# Altium schematic sheet HIVE_BOARD_CLOCK_GEN.SchDoc
size Tabloid; SheetNumber: 6; SheetTotal: 12; Sheet_Name: CLOCK GEN & FANOUT; Size: 11x17
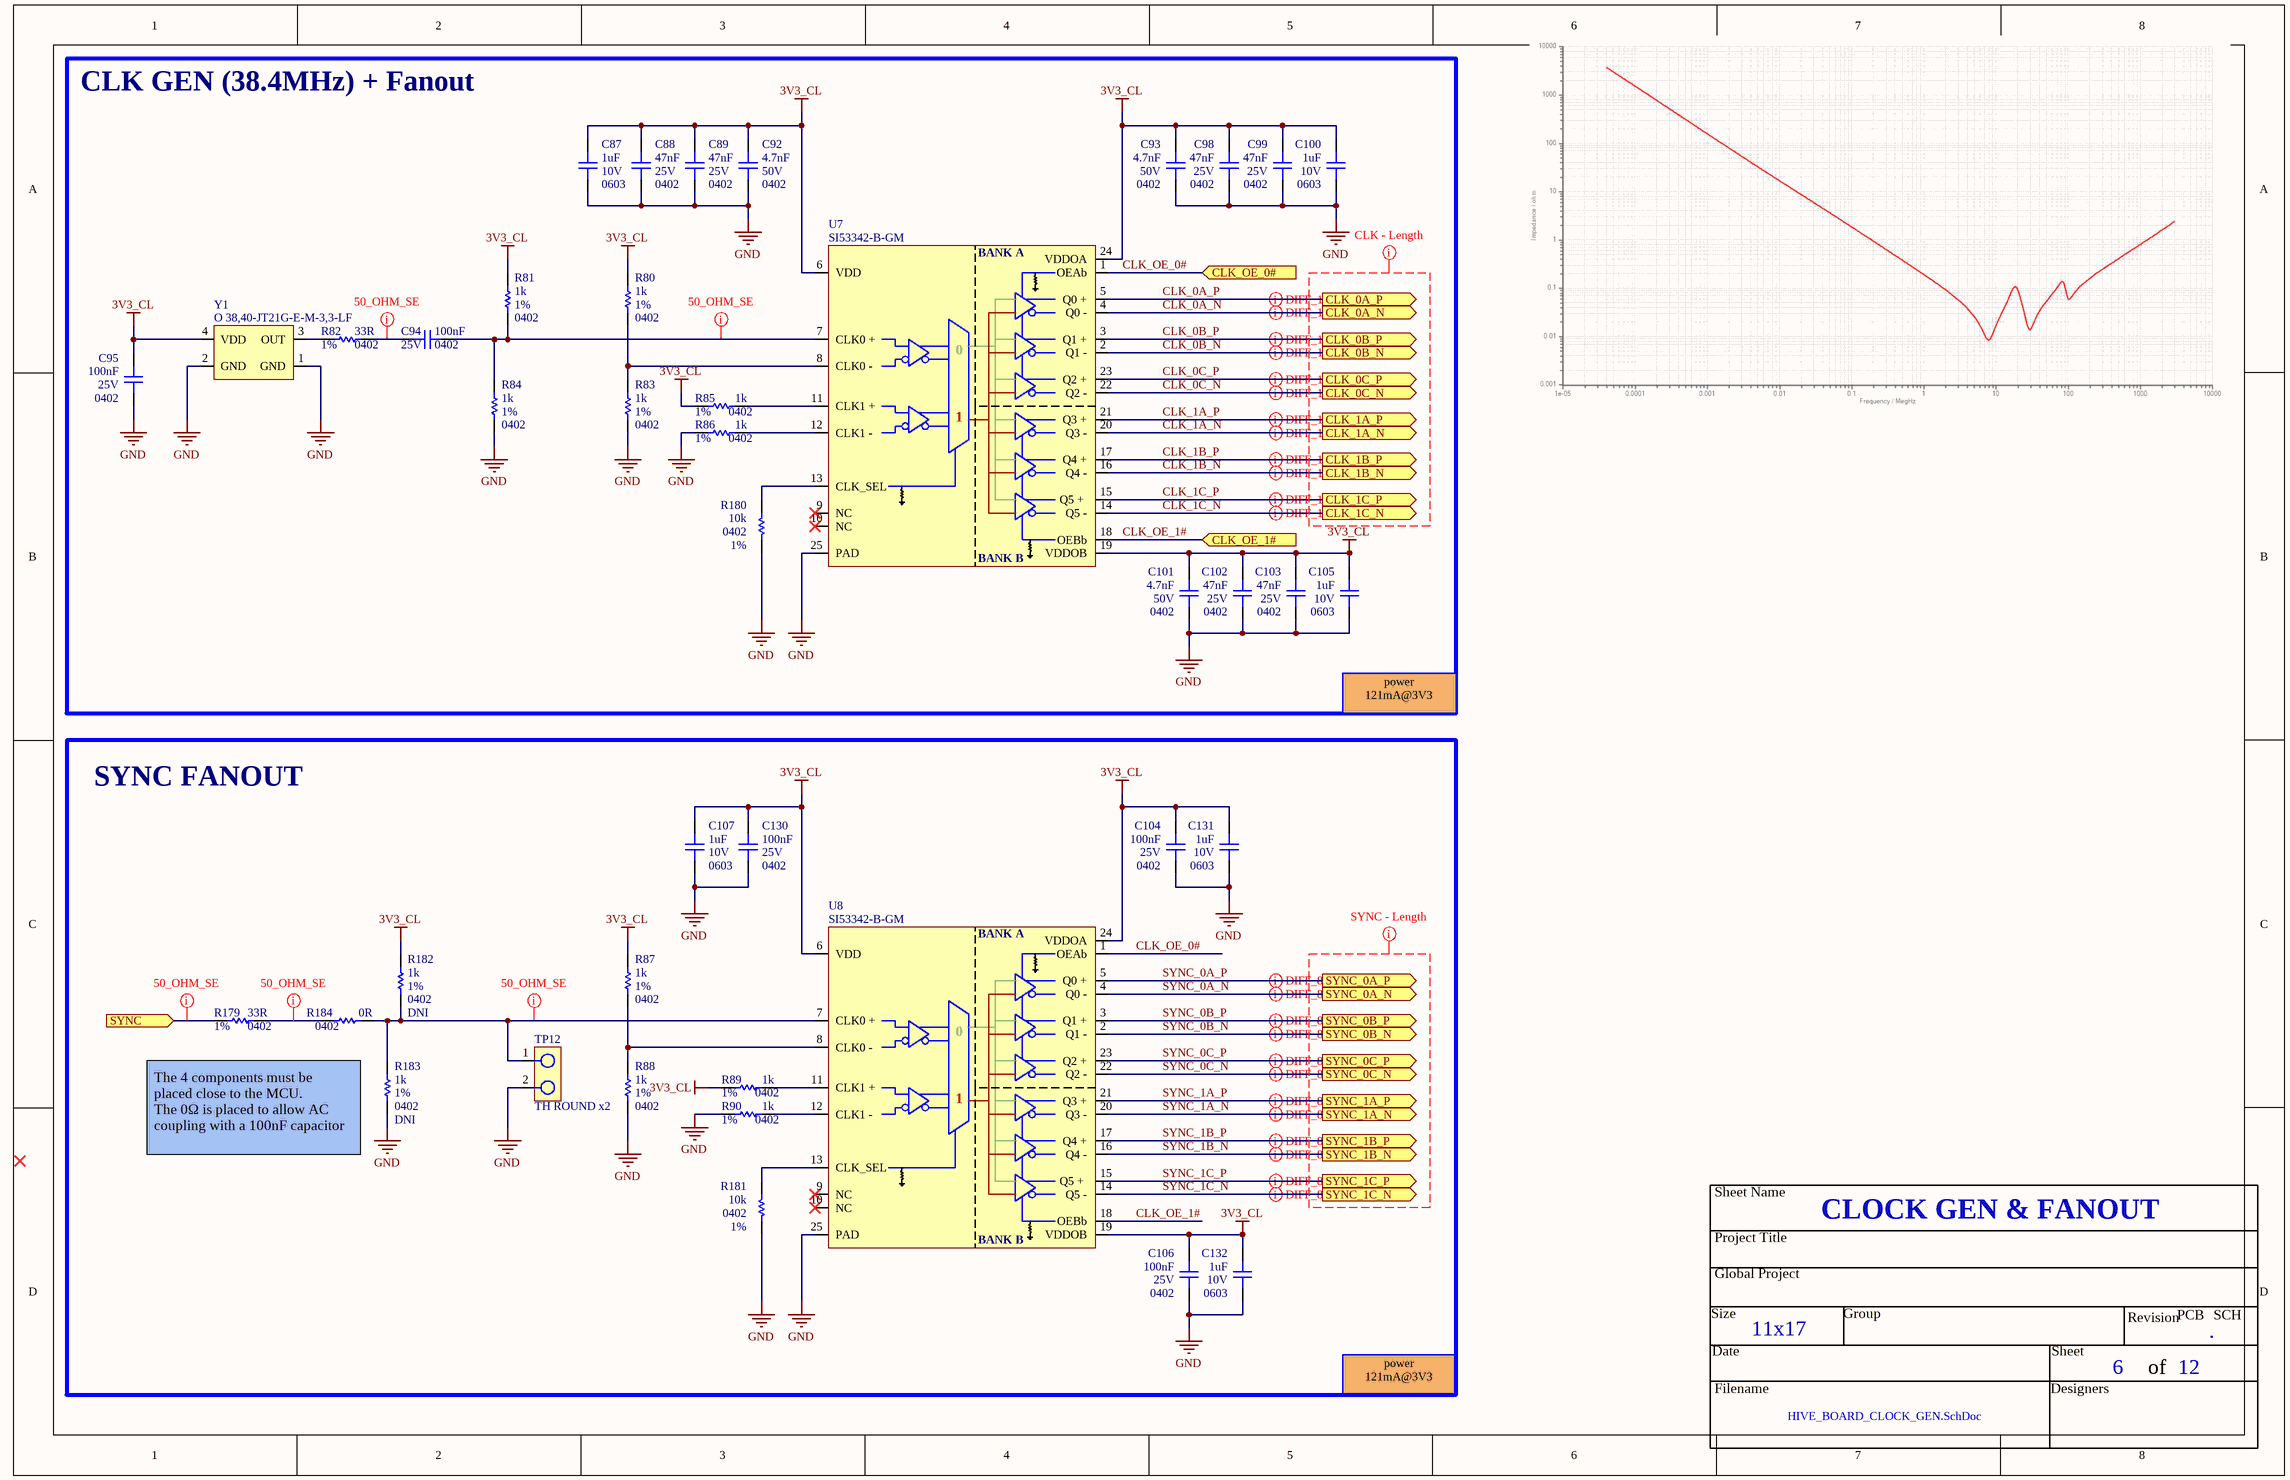
[diagram p0: HIVE_BOARD_CLOCK_GEN.SchDoc]

## Parts
C87  value 1uF  Package: 0603  Voltage Rating: 10V  [CAP_CER_0603]  (hidden comment: C0603C105K8PACTU)
C88  value 47nF  Package: 0402  Voltage Rating: 25V  [CAP_CER_0402]  (hidden comment: GRM155R71E473KA88J)
C89  value 47nF  Package: 0402  Voltage Rating: 25V  [CAP_CER_0402]  (hidden comment: GRM155R71E473KA88J)
C92  value 4.7nF  Package: 0402  Voltage Rating: 50V  [CAP_CER_0402]  (hidden comment: CL05B472KB5VPNC)
C93  value 4.7nF  Package: 0402  Voltage Rating: 50V  [CAP_CER_0402]  (hidden comment: CL05B472KB5VPNC)
C94  value 100nF  Package: 0402  Voltage Rating: 25V  [CAP_CER_0402]  (hidden comment: CGA2B3X7R1E104K050BB)
C95  value 100nF  Package: 0402  Voltage Rating: 25V  [CAP_CER_0402]  (hidden comment: CGA2B3X7R1E104K050BB)
C98  value 47nF  Package: 0402  Voltage Rating: 25V  [CAP_CER_0402]  (hidden comment: GRM155R71E473KA88J)
C99  value 47nF  Package: 0402  Voltage Rating: 25V  [CAP_CER_0402]  (hidden comment: GRM155R71E473KA88J)
C100  value 1uF  Package: 0603  Voltage Rating: 10V  [CAP_CER_0603]  (hidden comment: C0603C105K8PACTU)
C101  value 4.7nF  Package: 0402  Voltage Rating: 50V  [CAP_CER_0402]  (hidden comment: CL05B472KB5VPNC)
C102  value 47nF  Package: 0402  Voltage Rating: 25V  [CAP_CER_0402]  (hidden comment: GRM155R71E473KA88J)
C103  value 47nF  Package: 0402  Voltage Rating: 25V  [CAP_CER_0402]  (hidden comment: GRM155R71E473KA88J)
C104  value 100nF  Package: 0402  Voltage Rating: 25V  [CAP_CER_0402]  (hidden comment: CGA2B3X7R1E104K050BB)
C105  value 1uF  Package: 0603  Voltage Rating: 10V  [CAP_CER_0603]  (hidden comment: C0603C105K8PACTU)
C106  value 100nF  Package: 0402  Voltage Rating: 25V  [CAP_CER_0402]  (hidden comment: CGA2B3X7R1E104K050BB)
C107  value 1uF  Package: 0603  Voltage Rating: 10V  [CAP_CER_0603]  (hidden comment: C0603C105K8PACTU)
C130  value 100nF  Package: 0402  Voltage Rating: 25V  [CAP_CER_0402]  (hidden comment: CGA2B3X7R1E104K050BB)
C131  value 1uF  Package: 0603  Voltage Rating: 10V  [CAP_CER_0603]  (hidden comment: C0603C105K8PACTU)
C132  value 1uF  Package: 0603  Voltage Rating: 10V  [CAP_CER_0603]  (hidden comment: C0603C105K8PACTU)
R80  value 1k  Tolerance: 1%  Package: 0402  [RES_0402]  (hidden comment: RC0402FR-071KL)
R81  value 1k  Tolerance: 1%  Package: 0402  [RES_0402]  (hidden comment: RC0402FR-071KL)
R82  value 33R  Tolerance: 1%  Package: 0402  [RES_0402]  (hidden comment: RC0402FR-0733RL)
R83  value 1k  Tolerance: 1%  Package: 0402  [RES_0402]  (hidden comment: RC0402FR-071KL)
R84  value 1k  Tolerance: 1%  Package: 0402  [RES_0402]  (hidden comment: RC0402FR-071KL)
R85  value 1k  Tolerance: 1%  Package: 0402  [RES_0402]  (hidden comment: RC0402FR-071KL)
R86  value 1k  Tolerance: 1%  Package: 0402  [RES_0402]  (hidden comment: RC0402FR-071KL)
R87  value 1k  Tolerance: 1%  Package: 0402  [RES_0402]  (hidden comment: RC0402FR-071KL)
R88  value 1k  Tolerance: 1%  Package: 0402  [RES_0402]  (hidden comment: RC0402FR-071KL)
R89  value 1k  Tolerance: 1%  Package: 0402  [RES_0402]  (hidden comment: RC0402FR-071KL)
R90  value 1k  Tolerance: 1%  Package: 0402  [RES_0402]  (hidden comment: RC0402FR-071KL)
R179  value 33R  Tolerance: 1%  Package: 0402  [RES_0402]  (hidden comment: RC0402FR-0733RL)
R180  value 10k  Tolerance: 1%  Package: 0402  [RES_0402]  (hidden comment: RC0402FR-0710KL)
R181  value 10k  Tolerance: 1%  Package: 0402  [RES_0402]  (hidden comment: RC0402FR-0710KL)
R182  value 1k  Tolerance: 1%  Assembly Note: DNI  Package: 0402  [RES_0402]  (hidden comment: RC0402FR-071KL)
R183  value 1k  Tolerance: 1%  Assembly Note: DNI  Package: 0402  [RES_0402]  (hidden comment: RC0402FR-071KL)
R184  value 0R  Package: 0402  [RES_0402]  (hidden comment: RC0402FR-070RL)
TP12  TH ROUND x2  [TPO_TH_ROUND_0.7mm_DOUBLE]  (no BOM)
U7  SI53342-B-GM  [TIM_FAN_SI53342-B-GM]
U8  SI53342-B-GM  [TIM_FAN_SI53342-B-GM]
Y1  O 38,40-JT21G-E-M-3,3-LF  [OSC_O 38,40-JT21G-E-M-3,3-LF]

## Blocks framed on the sheet
CLK GEN (38.4MHz) + Fanout: C87-C89 C92-C95 C98-C103 C105 R80-R86 R180 U7 Y1
SYNC FANOUT: C104 C106 C107 C130-C132 R87-R90 R179 R181-R184 TP12 U8

## Ports
CLK_0A_N (out), CLK_0A_P (out), CLK_0B_N (out), CLK_0B_P (out), CLK_0C_N (out), CLK_0C_P (out), CLK_1A_N (out), CLK_1A_P (out), CLK_1B_N (out), CLK_1B_P (out), CLK_1C_N (out), CLK_1C_P (out), CLK_OE_0# (in), CLK_OE_1# (in), SYNC (in), SYNC_0A_N (out), SYNC_0A_P (out), SYNC_0B_N (out), SYNC_0B_P (out), SYNC_0C_N (out), SYNC_0C_P (out), SYNC_1A_N (out), SYNC_1A_P (out), SYNC_1B_N (out), SYNC_1B_P (out), SYNC_1C_N (out), SYNC_1C_P (out)

## Nets
3V3_CL: C87.1 C88.2 C89.2 C92.2 C93.2 C95.2 C98.2 C99.2 C100.1 C101.2 C102.2 C103.2 C104.2 C105.1 C106.2 C107.1 C130.2 C131.1 C132.1 R80.2 R81.2 R85.2 R87.2 R89.2 R182.2 U7.6(VDD) U7.19(VDDOB) U7.24(VDDOA) U8.6(VDD) U8.19(VDDOB) U8.24(VDDOA) Y1.4(VDD)
GND: C87.2 C88.1 C89.1 C92.1 C93.1 C95.1 C98.1 C99.1 C100.2 C101.1 C102.1 C103.1 C104.1 C105.2 C106.1 C107.2 C130.1 C131.2 C132.2 R83.1 R84.1 R86.2 R88.1 R90.2 R180.2 R181.2 R183.1 TP12.2 U7.25(PAD) U8.25(PAD) Y1.1(GND) Y1.2(GND)
CLK_0A_N: U7.4(Q0_-) ; port CLK_0A_N
CLK_0A_P: U7.5(Q0_+) ; port CLK_0A_P
CLK_0B_N: U7.2(Q1_-) ; port CLK_0B_N
CLK_0B_P: U7.3(Q1_+) ; port CLK_0B_P
CLK_0C_N: U7.22(Q2_-) ; port CLK_0C_N
CLK_0C_P: U7.23(Q2_+) ; port CLK_0C_P
CLK_1A_N: U7.20(Q3_-) ; port CLK_1A_N
CLK_1A_P: U7.21(Q3_+) ; port CLK_1A_P
CLK_1B_N: U7.16(Q4_-) ; port CLK_1B_N
CLK_1B_P: U7.17(Q4_+) ; port CLK_1B_P
CLK_1C_N: U7.14(Q5_-) ; port CLK_1C_N
CLK_1C_P: U7.15(Q5_+) ; port CLK_1C_P
CLK_OE_0#: U7.1(OEAb) U8.1(OEAb) ; port CLK_OE_0#
CLK_OE_1#: U7.18(OEBb) U8.18(OEBb) ; port CLK_OE_1#
SYNC: R179.2 ; port SYNC
SYNC_0A_N: U8.4(Q0_-) ; port SYNC_0A_N
SYNC_0A_P: U8.5(Q0_+) ; port SYNC_0A_P
SYNC_0B_N: U8.2(Q1_-) ; port SYNC_0B_N
SYNC_0B_P: U8.3(Q1_+) ; port SYNC_0B_P
SYNC_0C_N: U8.22(Q2_-) ; port SYNC_0C_N
SYNC_0C_P: U8.23(Q2_+) ; port SYNC_0C_P
SYNC_1A_N: U8.20(Q3_-) ; port SYNC_1A_N
SYNC_1A_P: U8.21(Q3_+) ; port SYNC_1A_P
SYNC_1B_N: U8.16(Q4_-) ; port SYNC_1B_N
SYNC_1B_P: U8.17(Q4_+) ; port SYNC_1B_P
SYNC_1C_N: U8.14(Q5_-) ; port SYNC_1C_N
SYNC_1C_P: U8.15(Q5_+) ; port SYNC_1C_P
NetC94_1: C94.1 R81.1 R84.2 U7.7(CLK0_+)
NetC94_2: C94.2 R82.1
NetR80_1: R80.1 R83.2 U7.8(CLK0_-)
NetR82_2: R82.2 Y1.3(OUT)
NetR85_1: R85.1 U7.11(CLK1_+)
NetR86_1: R86.1 U7.12(CLK1_-)
NetR87_1: R87.1 R88.2 U8.8(CLK0_-)
NetR89_1: R89.1 U8.11(CLK1_+)
NetR90_1: R90.1 U8.12(CLK1_-)
NetR179_1: R179.1 R184.2
NetR180_1: R180.1 U7.13(CLK_SEL)
NetR181_1: R181.1 U8.13(CLK_SEL)
NetR182_1: R182.1 R183.2 R184.1 TP12.1 U8.7(CLK0_+)

Not connected (* = marked no-connect by the designer): U7 9(NC)* 10(NC)*; U8 9(NC)* 10(NC)*

## Layout directives
net class SE_50; net class SE_50: NetC94_1, NetC94_2
net class SE_50: NetR179_1, NetR182_1, SYNC
differential pair; differential pair class DIFF_100: CLK_0A_N, CLK_0A_P, CLK_0B_N, CLK_0B_P, CLK_0C_N, CLK_0C_P, CLK_1A_N, CLK_1A_P, CLK_1B_N, CLK_1B_P, CLK_1C_N, CLK_1C_P
differential pair; differential pair class DIFF_85: SYNC_0A_N, SYNC_0A_P, SYNC_0B_N, SYNC_0B_P, SYNC_0C_N, SYNC_0C_P, SYNC_1A_N, SYNC_1A_P, SYNC_1B_N, SYNC_1B_P, SYNC_1C_N, SYNC_1C_P
net class CLK_FAN; rule Matched Net Lengths [Tolerance = 1mil]: (no net found under the mark)
net class SYNC_FAN; rule Matched Net Lengths [Tolerance = 1mil]: (no net found under the mark)

## Notes on the sheet
- power
  121mA@3V3
- The 4 components must be placed close to the MCU.
  The 0Ω is placed to allow AC coupling with a 100nF capacitor
- Sheet Name
- Project Title
- Global Project
- Size
- Date
- Group
- Sheet
- Revision
- of
- PCB
- .
- SCH
- Filename
- Designers
- (in symbol TIM_FAN_SI53342-B-GM) BANK A; 0; BANK B

## Library data of the parts
C87 C100 C105 C107 C131 C132 = CAP_CER_C0603C105K8PACTU: CAP - CER 1uF 10V 10% X5R - 0603; Manufacturer #1: KEMET; GRAMS Lib Spec: 2.8; Magnetic Material: Unknown; Polarized: NO; Tolerance: 10%; Current Rating: *; Power Max: *; HelpURL: https://content.kemet.com/datasheets/KEM_C1006_X5R_SMD.pdf; CreatedBy/Date: Hubert Dube - 21/07/20; VerifiedBy: Louis-Daniel Gaulin - 21/07/20; Temperature: -55°C ~ 85°C; Manufacturer #2: *; Assembly Type: SMD; Part Number #2: *; Part Number #1: C0603C105K8PACTU; Cryo: UNKNOWN; Supplier 1: Digi-Key; Supplier Part Number 1: 399-3118-1-ND
C88 C89 C98 C99 C102 C103 = CAP_CER_GRM155R71E473KA88J: CAP - CER 47nF 25V X7R - 0402; Manufacturer #1: MURATA; GRAMS Lib Spec: 2.8c; Tolerance: 10%; Magnetic Material: Unknown; Polarized: No; Assembly Type: SMD; CreatedBy/Date: P. Marcoux 2020-02-05; Current Rating: *; HelpURL: https://ds.murata.co.jp/simsurfing/mlcc.html?partnumbers=%5B%22GRM155R71E473KA88%22%5D&oripartnumbers=%5B%22GRM155R71E473KA88J%22%5D&rgear=jomoqke&rgearinfo=ca; Manufacturer #2: *; Part Number #1: GRM155R71E473KA88J; Part Number #2: *; Power Max: *; Temperature: -55°C ~ 125°C; VerifiedBy: C.Paulin - 22/04/2020; Supplier 1: Digi-Key; Supplier Part Number 1: 490-6347-1-ND; Cryo: UNKNOWN
C92 C93 C101 = CAP_CER_CL05B472KB5VPNC: CAP - CER 4700PF 50V X7R 0402; Manufacturer #1: Samsung Electro-Mechanics; GRAMS Lib Spec: 2.8; Tolerance: ±10%; Magnetic Material: Unknown; Polarized: NO; Assembly Type: SMD; CreatedBy/Date: Philippe Arsenault/ 2021-03-26; Current Rating: *; HelpURL: https://www.samsungsem.com/resources/file/global/support/product_catalog/MLCC.pdf; Manufacturer #2: *; Note: *; Part Number #1: CL05B472KB5VPNC; Part Number #2: *; Power Max: *; Temperature: -55°C ~ 125°C; Cryo: UNKNOWN; Supplier 1: Digi-Key; Supplier Part Number 1: 1276-6576-1-ND
C94 C95 C104 C106 C130 = CAP_CER_CGA2B3X7R1E104K050BB: CAP - CER 0.1µF 10% 25V X7R - 0402; Manufacturer #1: TDK Corporation; GRAMS Lib Spec: 2.8; Magnetic Material: Unknown; Polarized: NO; Assembly Type: SMD; CreatedBy/Date: Nicolas Roy 2018-11-07; Current Rating: *; HelpURL: https://product.tdk.com/info/en/catalog/datasheets/mlcc_automotive_general_en.pdf; Manufacturer #2: *; Note: *; Part Number #1: CGA2B3X7R1E104K050BB; Part Number #2: *; Power Max: *; Temperature: -55°C ~ 125°C; Tolerance: 10%; VerifiedBy: Nicolas V. (2019-01-22); Supplier 1: Digi-Key; Supplier Part Number 1: 445-6902-1-ND; Cryo: UNKNOWN
R80 R81 R83-R90 R182 R183 = RES_RC0402FR-071KL: RES - 1K OHM 1% 1/16W - 0402; Manufacturer #1: Yageo; GRAMS Lib Spec: 2.8; Magnetic Material: YES; Polarized: NO; Voltage Rating: 50V; Cryo: UNKNOWN; Assembly Type: SMD; CreatedBy/Date: Jonathan Bouchard 2018-07-05; Current Rating: *; HelpURL: http://www.yageo.com/documents/recent/PYu-RC_Group_51_RoHS_L_9.pdf; Manufacturer #2: *; Note: *; Part Number #1: RC0402FR-071KL; Part Number #2: *; Power Max: 1/16W; Temperature: -55°C ~ 155°C; VerifiedBy: Arnaud Samson 16-07-18; Supplier 1: Digi-Key; Supplier Part Number 1: 311-1.00KLRCT-ND
R82 R179 = RES_RC0402FR-0733RL: RES - 33 OHM 1% 1/16W - 0402; Manufacturer #1: Yageo; GRAMS Lib Spec: 2.8c; Magnetic Material: Unknown; Polarized: NO; Voltage Rating: 50V; Assembly Type: SMD; CreatedBy/Date: Louis-Daniel Gaulin/ 14/01/2020; Current Rating: *; HelpURL: https://www.yageo.com/upload/media/product/productsearch/datasheet/rchip/PYu-RC_Group_51_RoHS_L_10.pdf; Manufacturer #2: *; Note: *; Part Number #1: RC0402FR-0733RL; Part Number #2: *; Power Max: 1/16W; Temperature: -55°C ~ 155°C; VerifiedBy: C.Paulin - 21/01/2020; Supplier 1: Digi-Key; Supplier Part Number 1: 311-33.0LRCT-ND; Cryo: UNKNOWN
R180 R181 = RES_RC0402FR-0710KL: RES - 10K OHMS 1% 1/16W - 0402; Manufacturer #1: Yageo; GRAMS Lib Spec: 2.8; Magnetic Material: UNKNOWN; Polarized: NO; Voltage Rating: 50V; Assembly Type: SMD; CreatedBy/Date: Nicolas V. (2018-11-20); Current Rating: *; HelpURL: http://www.yageo.com/documents/recent/PYu-RC_Group_51_RoHS_L_9.pdf; Manufacturer #2: *; Note: *; Part Number #1: RC0402FR-0710KL; Part Number #2: *; Power Max: 1/16W; Temperature: -55°C ~ 155°C; VerifiedBy: Nicolas V. (2018-11-20); Supplier 1: Digi-Key; Supplier Part Number 1: 311-10.0KLRCT-ND; Cryo: UNKNOWN; Solder Paste Type: UNKNOWN; Stencil Thickness (Recommended): UNKNOWN
R184 = RES_RC0402FR-070RL: RES - 0R 1/16W 1A  - 0402; Manufacturer #1: Yageo; GRAMS Lib Spec: 2.8; Magnetic Material: Unknown; Polarized: No; Voltage Rating: 50V; Assembly Type: SMD; CreatedBy/Date: Keven Deslandes 2018-09-12; Current Rating: 1A; HelpURL: http://www.yageo.com/documents/recent/PYu-RC_Group_51_RoHS_L_10.pdf; Manufacturer #2: *; Note: *; Part Number #1: RC0402FR-070RL; Part Number #2: *; Power Max: 1/16W; Temperature: -55°C ~ 155°C; VerifiedBy: Caroline Paulin - 27 fév 2019; Supplier 1: Digi-Key; Supplier Part Number 1: 311-0.0LRCT-ND; Cryo: UNKNOWN
TP12 = TPO_TH_ROUND_0.7mm_DOUBLE: TPO - TH round 0.7mm double - 2-SMD; GRAMS Lib Spec: 2.8; Tolerance: -; Voltage Rating: -; Current Rating: -; Power Max: -; HelpURL: -; CreatedBy/Date: Philippe Arsenault / 20-04-2021; VerifiedBy: Louis-Daniel Gaulin / 29-04-2021; Temperature: -; Package: 2-SMD; Manufacturer #1: -; Manufacturer #2: -; Note: -; Assembly Type: TH; Part Number #2: -; Part Number #1: -; Magnetic Material: -; Polarized: -; Supplier 1: -; Supplier Part Number 1: -
U7 U8 = TIM_FAN_SI53342-B-GM: TIM_FAN -  Clock Fanout Buffer 1.25GHz , Multiplexer IC 2:6 - 24-VFQFN EP; Manufacturer #1: Silicon Labs; Voltage Rating: 1.71V ~ 3.63V; Current Rating: 121mA; GRAMS Lib Spec: 2.8; Magnetic Material: Unknown; Polarized: YES; Value: 2:6; HelpURL: https://www.silabs.com/documents/public/data-sheets/si5334x-datasheet.pdf; CreatedBy/Date: Philippe Arsenault/ 2021-04-01; Temperature: -40°C ~ 85°C; Package: 24-QFN; Assembly Type: SMD; Part Number #1: SI53342-B-GM; Supplier 1: Digi-Key; Supplier Part Number 1: 336-3840-ND
Y1 = OSC_O 38,40-JT21G-E-M-3,3-LF: OSC -  TCXO Clipped Sine Wave Oscillator 3.3V 38.4MHz - 4-SMD; Manufacturer #1: Jauch Quartz; Tolerance: ±2 ppm; Voltage Rating: 3.14V~3.46V; Current Rating: 2mA; Power Max: 7mW; GRAMS Lib Spec: 2.8; Magnetic Material: Unknown; Polarized: Yes; Value: 38.4 MHz; HelpURL: https://www.jauch.com/downloadfile/5ea1ac91e1fcc808473bf53821b4b903d/jt21g_200519_online.pdf; CreatedBy/Date: Louis-Daniel Gaulin / 30-04-2021; VerifiedBy: Philippe Arsenault/2021-04-30; Temperature: -30°C ~ 85°C; Package: SMD-4; Assembly Type: SMD; Part Number #1: O 38,40-JT21G-E-M-3,3-LF; Supplier 1: Digi-Key; Supplier Part Number 1: 1908-O38,40-JT21G-E-M-3,3-LFCT-ND